# Altium schematic sheet Top.SchDoc
size A; SheetNumber: 1; SheetTotal: 2
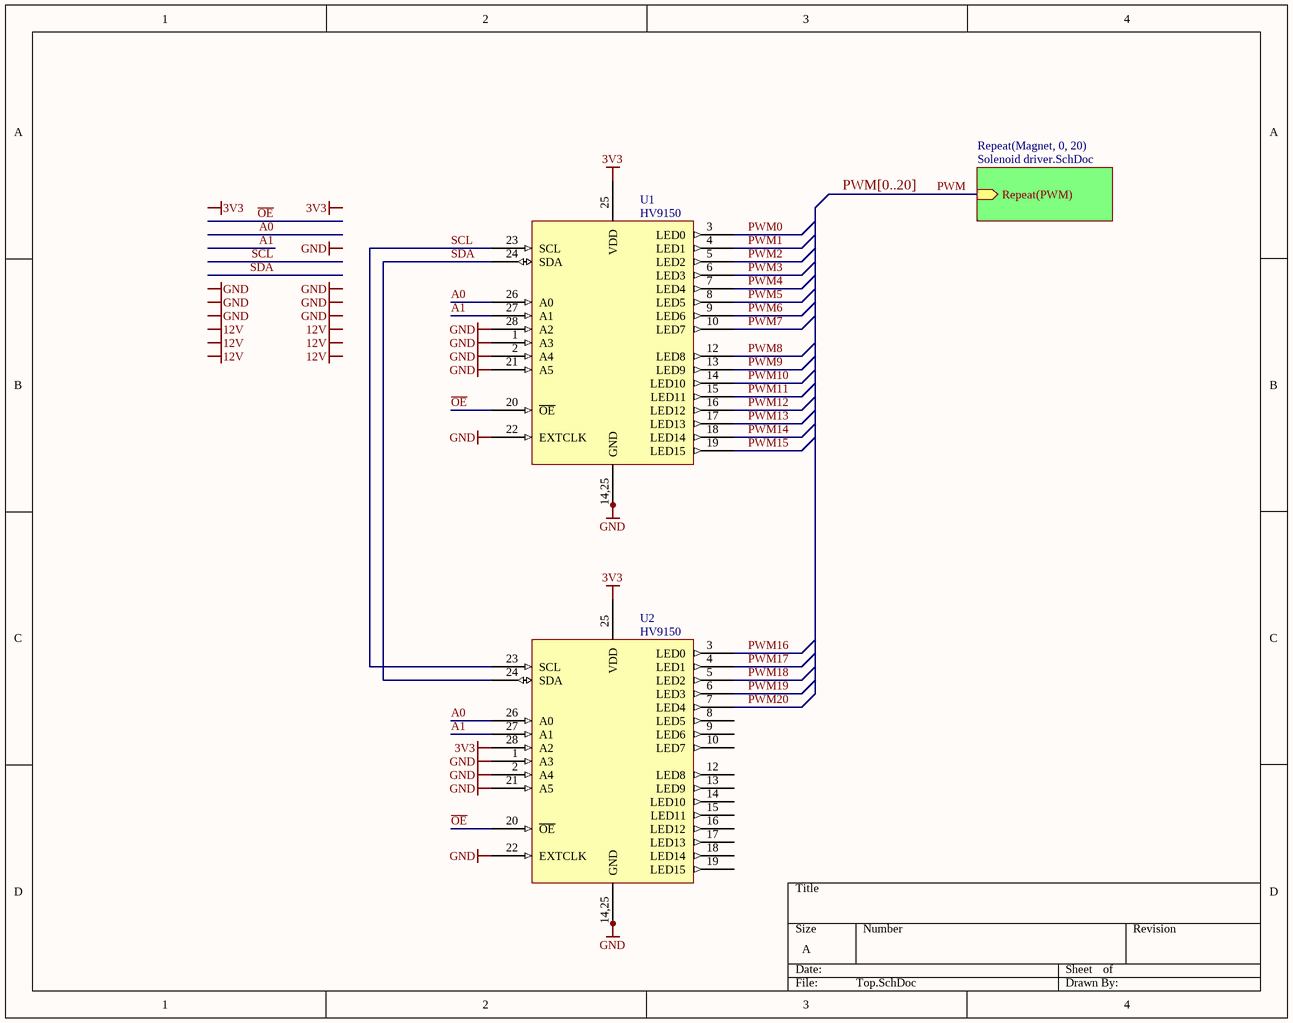
[diagram p0: Top.SchDoc]

## Parts
U1  HV9150  [QFN-28]
U2  HV9150  [QFN-28]

## Sub-sheets
Repeat(Magnet, 0, 20) = Solenoid driver.SchDoc: Repeat(PWM) (in)

## Nets
3V3: U1.25(VDD) U2.25(VDD) U2.28(A2)
GND: U1.1(A3) U1.2(A4) U1.14,25(GND) U1.21(A5) U1.22(EXTCLK) U1.25(GND) U1.28(A2) U2.1(A3) U2.2(A4) U2.14,25(GND) U2.21(A5) U2.22(EXTCLK) U2.25(GND)
A0: U1.26(A0) U2.26(A0)
A1: U1.27(A1) U2.27(A1)
~{OE}: U1.20(~{OE}) U2.20(~{OE})
PWM: sheet Repeat(Magnet, 0, 20)/Repeat(PWM)
PWM0: U1.3(LED0)
PWM1: U1.4(LED1)
PWM2: U1.5(LED2)
PWM3: U1.6(LED3)
PWM4: U1.7(LED4)
PWM5: U1.8(LED5)
PWM6: U1.9(LED6)
PWM7: U1.10(LED7)
PWM8: U1.12(LED8)
PWM9: U1.13(LED9)
PWM10: U1.14(LED10)
PWM11: U1.15(LED11)
PWM12: U1.16(LED12)
PWM13: U1.17(LED13)
PWM14: U1.18(LED14)
PWM15: U1.19(LED15)
PWM16: U2.3(LED0)
PWM17: U2.4(LED1)
PWM18: U2.5(LED2)
PWM19: U2.6(LED3)
PWM20: U2.7(LED4)
SCL: U1.23(SCL) U2.23(SCL)
SDA: U1.24(SDA) U2.24(SDA)

Not connected (* = marked no-connect by the designer): U2 8(LED5) 9(LED6) 10(LED7) 12(LED8) 13(LED9) 14(LED10) 15(LED11) 16(LED12) 17(LED13) 18(LED14) 19(LED15)

## Buses and harness runs
bus PWM[0..20]

## Notes on the sheet
- Labels drawn without touching a wire or pin: 3V3, 12V, GND

## Library data of the parts
U1 U2 = PCA9685: High-Voltage Output Hysteretic-Mode Step-Up DC/DC Controller; Ref: HV9150